# Altium schematic sheet СТЖ-1-ПУ-02-00-001.SchDoc
size 420 x 297 mm; Date: 01.23; CheckedBy: Козуто; Author: Большаков; PageSetup: Record=PageOptions|CenterHorizontal=True|CenterVertical=True|PrintScale=0.94|XCorrection=1.00|YCorrection=1.00|PrintKind=1|BorderSize=5000000|LeftOffset=0|BottomOffset=0|Orientation=1|PaperLength=1000|PaperWidth=1000|Scale=100|PaperSource=7|PrintQuality=-4|MediaType=1|DitherType=10|PaperKind=A4|PrintScaleMode=1; DecimalNumber: СТЖ-1.ПУ.02.00.001; MainDevice: Перв.примен.; Name: Пульт управления
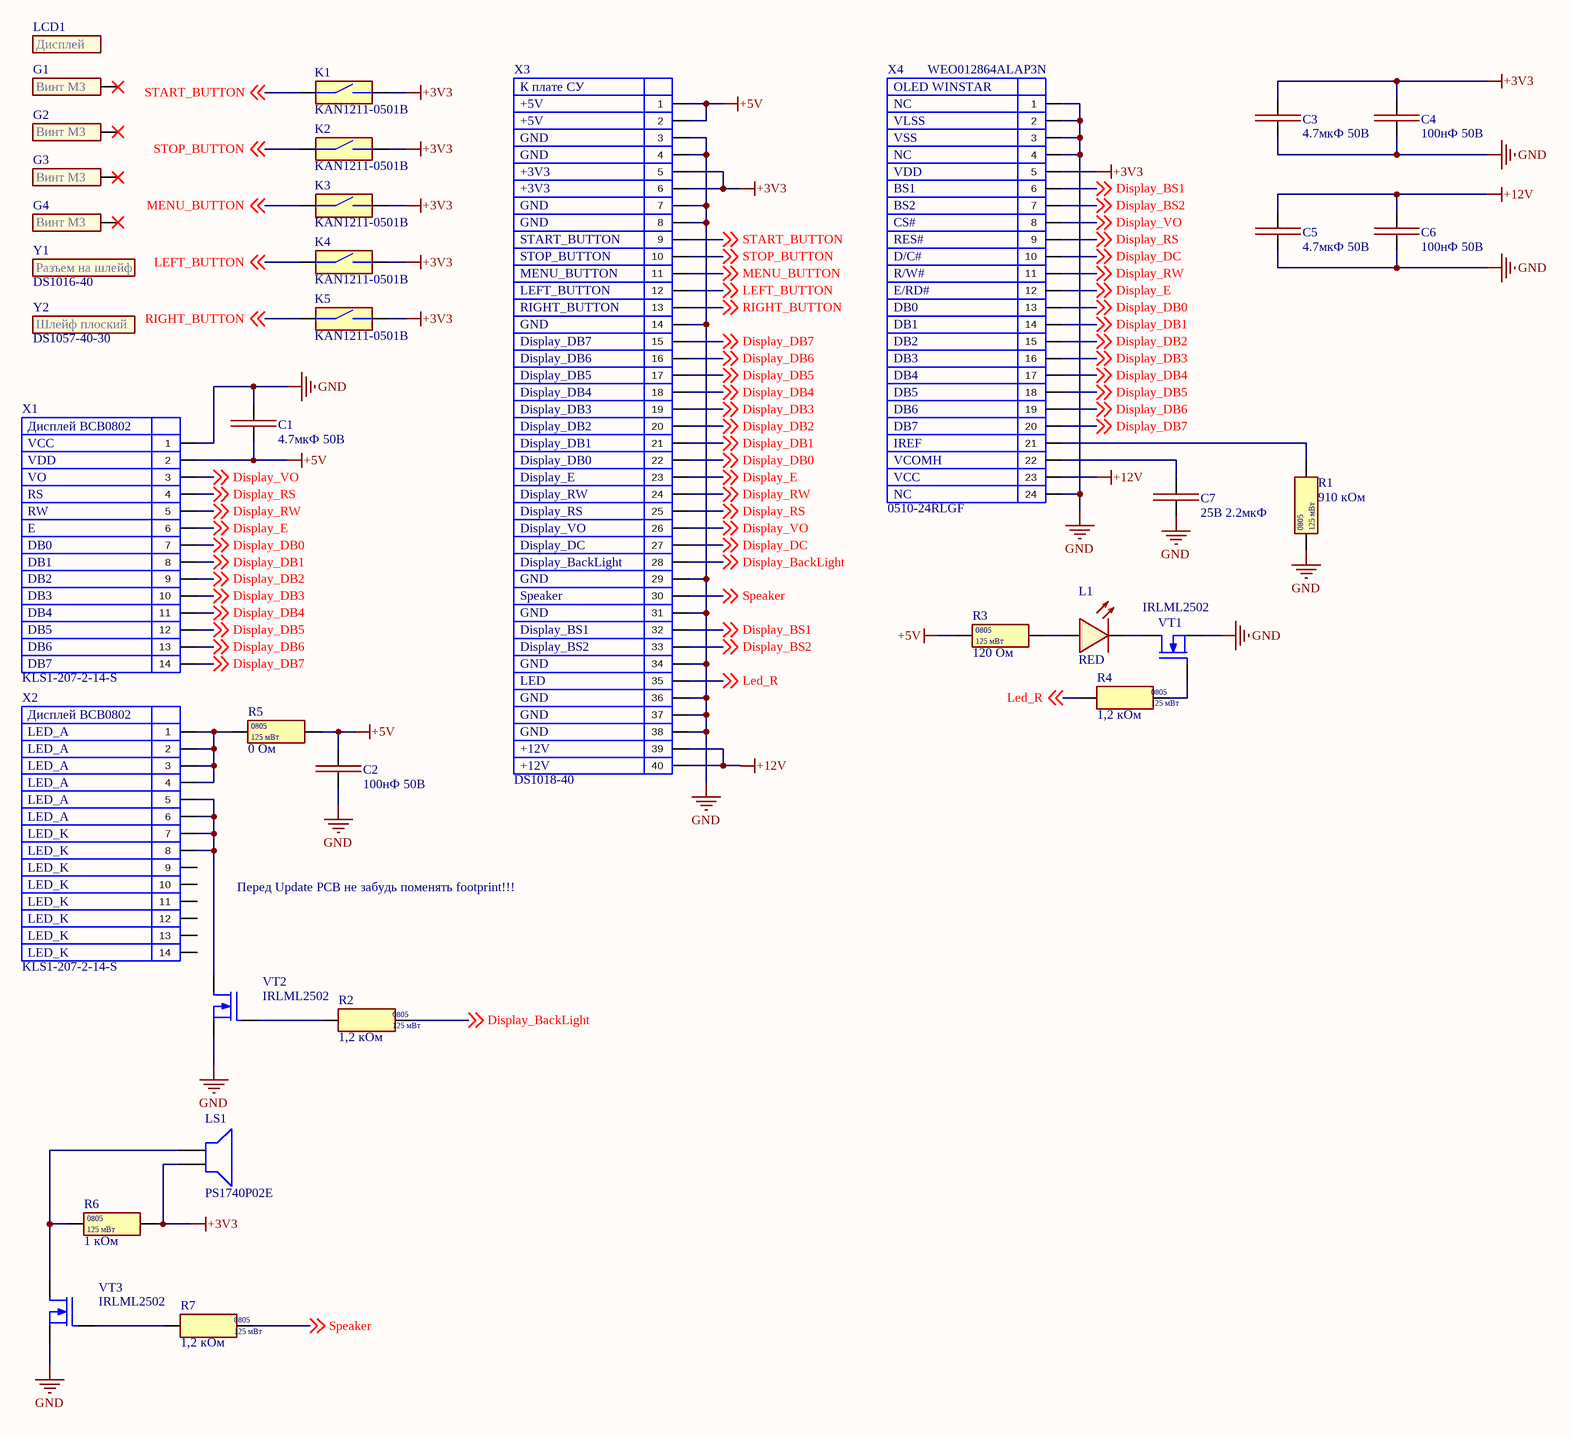
[diagram p0: СТЖ-1-ПУ-02-00-001.SchDoc]

## Parts
C1  4.7мкФ 50В  [C-1206]
C2  100нФ 50В  [C-0805]
C3  4.7мкФ 50В  [C-1206]
C4  100нФ 50В  [C-0805]
C5  4.7мкФ 50В  [C-1206]
C6  100нФ 50В  [C-0805]
C7  25В 2.2мкФ  [C-0805-1.25h]
G1  Винт М3  [Standoff M3 - without 3D]  (value not drawn)  (no BOM)
G2  Винт М3  [Standoff M3 - without 3D]  (value not drawn)  (no BOM)
G3  Винт М3  [Standoff M3 - without 3D]  (value not drawn)  (no BOM)
G4  Винт М3  [Standoff M3 - without 3D]  (value not drawn)  (no BOM)
K1  KAN1211-0501B  [Tactile switch 12X12X5mm smd]
K2  KAN1211-0501B  [Tactile switch 12X12X5mm smd]
K3  KAN1211-0501B  [Tactile switch 12X12X5mm smd]
K4  KAN1211-0501B  [Tactile switch 12X12X5mm smd]
K5  KAN1211-0501B  [Tactile switch 12X12X5mm smd]
L1  RED  [LED_0805_KB]
LCD1  Дисплей  [BCB0802-02-BL]  (value not drawn)  (no BOM)
LS1  PS1740P02E  [PS1740P02E]
R1  910 кОм  [R-0805]
R2  1,2 кОм  [R-0805]
R3  120 Ом  [R-0805]
R4  1,2 кОм  [R-0805]
R5  0 Ом  [R-0805]
R6  1 кОм  [R-0805]
R7  1,2 кОм  [R-0805]
VT1  IRLML2502  [SOT-23]
VT2  IRLML2502  [SOT-23]
VT3  IRLML2502  [SOT-23]
X1  KLS1-207-2-14-S  [PLS-2x14]
X2  KLS1-207-2-14-S  [PLS-2x8 for BCB0802-02-BL]
X3  DS1018-40  [FDC-40]
X4  0510-24RLGF  [FPC 24pin]
Y1  DS1016-40  (no BOM)
Y2  DS1057-40-30  (no BOM)

## Nets
+3V3: C3.2 C4.2 K1.2 K2.2 K3.2 K4.2 K5.2 LS1.1 R6.2 X3.5 X3.6 X4.5
+5V: C1.1 C2.2 R3.1 R5.2 X1.2 X3.1 X3.2
+12V: C5.2 C6.2 X3.39 X3.40 X4.23
GND: C1.2 C2.1 C3.1 C4.1 C5.1 C6.1 C7.1 R1.1 VT1.2(S) VT2.2(S) VT3.2(S) X1.1 X3.3 X3.4 X3.7 X3.8 X3.14 X3.29 X3.31 X3.34 X3.36 X3.37 X3.38 X4.1 X4.2 X4.3 X4.4 X4.24
Display_BackLight: R2.1 X3.28 ; off-sheet Display_BackLight
Display_BS1: X3.32 X4.6 ; off-sheet Display_BS1
Display_BS2: X3.33 X4.7 ; off-sheet Display_BS2
Display_DB0: X1.7 X3.22 X4.13 ; off-sheet Display_DB0
Display_DB1: X1.8 X3.21 X4.14 ; off-sheet Display_DB1
Display_DB2: X1.9 X3.20 X4.15 ; off-sheet Display_DB2
Display_DB3: X1.10 X3.19 X4.16 ; off-sheet Display_DB3
Display_DB4: X1.11 X3.18 X4.17 ; off-sheet Display_DB4
Display_DB5: X1.12 X3.17 X4.18 ; off-sheet Display_DB5
Display_DB6: X1.13 X3.16 X4.19 ; off-sheet Display_DB6
Display_DB7: X1.14 X3.15 X4.20 ; off-sheet Display_DB7
Display_DC: X3.27 X4.10 ; off-sheet Display_DC
Display_E: X1.6 X3.23 X4.12 ; off-sheet Display_E
Display_RS: X1.4 X3.25 X4.9 ; off-sheet Display_RS
Display_RW: X1.5 X3.24 X4.11 ; off-sheet Display_RW
Display_VO: X1.3 X3.26 X4.8 ; off-sheet Display_VO
Led_R: R4.2 X3.35 ; off-sheet Led_R
LEFT_BUTTON: K4.1 X3.12 ; off-sheet LEFT_BUTTON
MENU_BUTTON: K3.1 X3.11 ; off-sheet MENU_BUTTON
RIGHT_BUTTON: K5.1 X3.13 ; off-sheet RIGHT_BUTTON
Speaker: R7.1 X3.30 ; off-sheet Speaker
START_BUTTON: K1.1 X3.9 ; off-sheet START_BUTTON
STOP_BUTTON: K2.1 X3.10 ; off-sheet STOP_BUTTON
NetC7_2: C7.2 X4.22
NetL1_1: L1.1 R3.2
NetL1_2: L1.2(1.27) VT1.3(D)
NetLS1_2: LS1.2 R6.1 VT3.3(D)
NetR1_2: R1.2 X4.21
NetR2_2: R2.2 VT2.1(G)
NetR4_1: R4.1 VT1.1(G)
NetR5_1: R5.1 X2.1 X2.2 X2.3 X2.4
NetR7_2: R7.2 VT3.1(G)
NetVT2_3: VT2.3(D) X2.5 X2.6 X2.7 X2.8

Not connected (* = marked no-connect by the designer): G1 G*; G2 G*; G3 G*; G4 G*; X2 9 10 11 12 13 14

## Notes on the sheet
- К плате СУ
- +5V
- OLED WINSTAR
- NC
- (near X4) WEO012864ALAP3N
- GND
- +3V3
- VLSS
- VSS
- VDD
- START_BUTTON
- BS1
- BS2
- CS#
- RES#
- STOP_BUTTON
- MENU_BUTTON
- LEFT_BUTTON
- RIGHT_BUTTON
- D/C#
- R/W#
- E/RD#
- DB0
- Display_DB5
- Display_DB6
- Display_DB7
- DB1
- DB2
- DB3
- DB4
- (near X1) Дисплей BCB0802
- VCC
- Display_DB0
- Display_DB1
- Display_DB2
- Display_DB3
- Display_DB4
- IREF
- VCOMH
- DB5
- DB6
- DB7
- VO
- RS
- RW
- E
- Display_VO
- Display_RS
- Display_RW
- Display_E
- Display_DС
- (near X3) Display_BackLight
- Speaker
- Display_BS1
- Display_BS2
- LED_A
- Дисплей BCB0802
- +12V
- LED
- LED_K
- (near X2) Перед Update PCB не забудь поменять footprint!!!
- Перв.примен.
- Справ.№
- Подп. и дата
- Инв.№ дубл.
- Взам.инв.№
- Подп.и дата
- Разраб.
- Изм.
- Лист
- № докум.
- Подп.
- Дата
- Лит.
- Масштаб
- Масса
- Т.контр.
- Пров.
- СХЕМА   ЭЛЕКТРИЧЕСКАЯ
- ПРИНЦИПИАЛЬНАЯ
- Листов
- Инв.№ подл.
- Утв.
- Н.контр.
- Нач.сект.
- Формат  A3
- (in symbol DS1057-40-30 (FRC-40-30)) Шлейф плоский
- (in symbol IDC-40F (DS1016-40)) Разъем на шлейф
- (in symbol RC0805JR-070RL) 0805; 125 мВт
- (in symbol RC0805JR-071K2L) 0805; 125 мВт
- (in symbol RC0805JR-071KL) 0805; 125 мВт
- (in symbol RC0805JR-07120RL) 0805; 125 мВт
- (in symbol RC0805JR-07910KL) 0805; 125 мВт

## Library data of the parts
C1 C3 C5 = CC1206KKX7R9BB475: Конденсатор 1206 10% 50В 4.7мкФ X7R; Value: Керамический конденсатор X7R 4.7мкФ ±10% 50В, 1206; Note: Yageo
C2 C4 C6 = GRM21BR71H104KA01L: Конденсатор 0805 10% 50В 100нФ X7R; Value: Керам. ЧИП конд. 0,1 мкФ - 50 В - X7R - 10 % - 0805
C7 = GRM21BR71E225KA73L: Конденсатор 0805 10% 25В 2.2мкФ X7R; Value: Керам. ЧИП конд. 2,2 мкФ - 25 В - X7R - 10 % - 0805; Note: MURATA corp.
G1-G4 = Винт М3: Винт М3 DIN 967
K1-K5 = KAN1211-0501B: Кнопка тактовая 12x12x5
L1 = KP-2012SURCK: Светодиод 0805 RED 2,5В 230мКд; Value: Керам. ЧИП конд. 2,2 мкФ - 25 В - X7R - 10 % - 0805; Note: MURATA corp.
LS1 = PS1740P02E: Loudspeaker or Buzzer; Manufacturer_Name: TDK; Datasheet Link: https://product.tdk.com/system/files/dam/doc/product/sw_piezo/sw_piezo/piezo-buzzer/catalog/piezoelectronic_buzzer_ps_en.pdf; Height: 7.8mm; Manufacturer_Part_Number: PS1740P02E; Mouser Part Number: 810-PS1740P02E; Mouser Price/Stock: https://www.mouser.co.uk/ProductDetail/TDK/PS1740P02E?qs=80T3JVN997CRFROxd67bkQ%3D%3D; Arrow Part Number: PS1740P02E; Arrow Price/Stock: https://www.arrow.com/en/products/ps1740p02e/tdk?region=nac
R1 = RC0805JR-07910KL: Резистор 0805 5% 910 кОм; Value: Чип резистор 360 кОм - 0,125 Вт - 5% - 0805; Note: YAGEO
R2 R4 R7 = RC0805JR-071K2L: Резистор 0805 5% 1,2 кОм; Value: Чип резистор 1,2 кОм - 0,125 Вт - 5 % - 0805; Note: YAGEO
R3 = RC0805JR-07120RL: Резистор 0805 5% 120 Ом; Value: Чип резистор 120 Ом - 0,125 Вт - 5% - 0805; Note: YAGEO
R5 = RC0805JR-070RL: Резистор 0805 5% 0 Ом; Value: Чип резистор 0 Ом - 0,125 Вт - 5% - 0805; Note: YAGEO
R6 = RC0805JR-071KL: Резистор 0805 5% 1 кОм; Value: Чип резистор 1 кОм - 0,125 Вт - 5 % - 0805
VT1-VT3 = IRLML2502: Транзистор MOSFET N-Channel 20В 4.2А; Value: DMG1012T-7, MOSFET N-Channel 20V 0.63, SOT-523
X1 X2 = KLS1-207-2-14-S: Разъем PLS-14, шаг 2.54 мм; Value: Вилка на плату PLS-4, шаг 2.54 мм
X3 = FDC-40 (DS1018-40): Разъем шлейф, шаг 2.54 мм; Value: Вилка на плату PLS-4, шаг 2.54 мм
X4 = 0510-24RLGF: Разъем FPC Flip-Lock 24p 0,5мм; Value: Вилка на плату PLS-4, шаг 2.54 мм
Y1 = IDC-40F (DS1016-40): Разъем на шлейф IDC-40F (DS1016-40)
Y2 = DS1057-40-30 (FRC-40-30): Шлейф плоский 1,27мм 40 жил